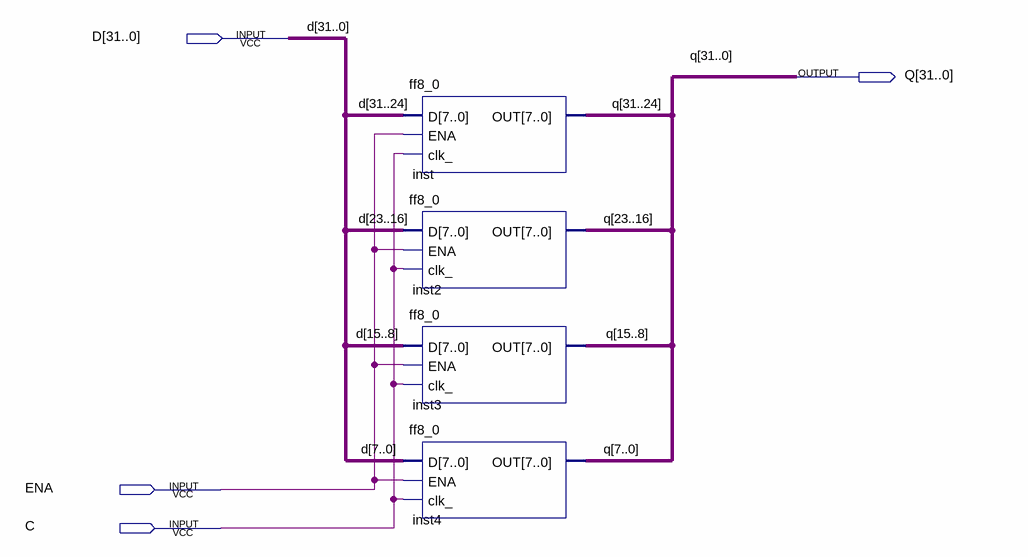
[diagram p0: schematic sheet]
// Quartus schematic ff_en32_0.bdf as structural Verilog: 4 symbols, 4 pins
module ff_en32_0 (
  input  [31:0] D,
  input  ENA,
  input  C,
  output [31:0] Q
);

  ff8_0 inst (.D(D[31:24]), .ENA(ENA), .clk_(C), .OUT(Q[31:24]));
  ff8_0 inst2 (.D(D[23:16]), .ENA(ENA), .clk_(C), .OUT(Q[23:16]));
  ff8_0 inst3 (.D(D[15:8]), .ENA(ENA), .clk_(C), .OUT(Q[15:8]));
  ff8_0 inst4 (.D(D[7:0]), .ENA(ENA), .clk_(C), .OUT(Q[7:0]));
endmodule
